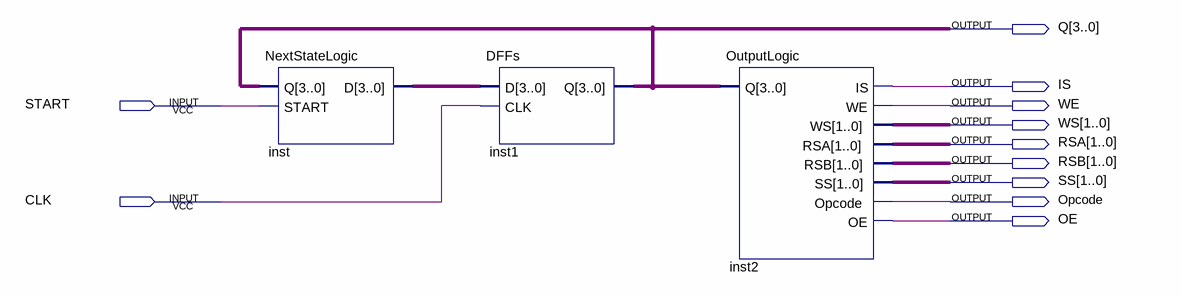
[diagram p0: schematic sheet]
// Quartus schematic Controller.bdf as structural Verilog: 3 symbols, 11 pins
module Controller (
  input  START,
  input  CLK,
  output [3:0] Q,
  output IS,
  output WE,
  output [1:0] WS,
  output [1:0] RSA,
  output [1:0] RSB,
  output [1:0] SS,
  output Opcode,
  output OE
);

  wire [3:0] inst_d;

  NextStateLogic inst (.Q(Q), .START(START), .D(inst_d));
  DFFs inst1 (.D(inst_d), .CLK(CLK), .Q(Q));
  OutputLogic inst2 (.Q(Q), .IS(IS), .WE(WE), .WS(WS), .RSA(RSA), .RSB(RSB), .SS(SS), .Opcode(Opcode), .OE(OE));
endmodule
